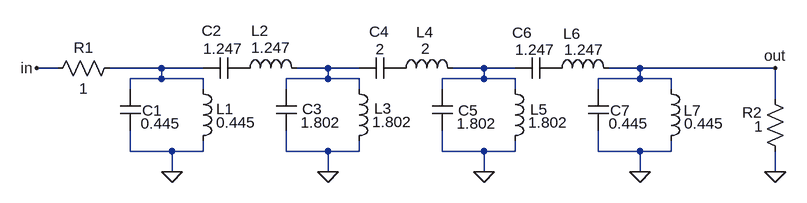
[diagram p0: schematic band_pass_prototype.asc]
band_pass_prototype.asc, the LTspice schematic file:
Version 4
SHEET 1 884 680
WIRE -256 -128 -288 -128
WIRE -96 -128 -176 -128
WIRE -32 -128 -96 -128
WIRE 160 -128 112 -128
WIRE 208 -128 160 -128
WIRE 400 -128 352 -128
WIRE 448 -128 400 -128
WIRE 640 -128 592 -128
WIRE 848 -128 640 -128
WIRE -96 -112 -96 -128
WIRE -96 -112 -144 -112
WIRE -32 -112 -96 -112
WIRE 160 -112 160 -128
WIRE 160 -112 96 -112
WIRE 208 -112 160 -112
WIRE 400 -112 400 -128
WIRE 400 -112 336 -112
WIRE 448 -112 400 -112
WIRE 640 -112 640 -128
WIRE 640 -112 576 -112
WIRE 688 -112 640 -112
WIRE -144 -96 -144 -112
WIRE -32 -96 -32 -112
WIRE 96 -96 96 -112
WIRE 208 -96 208 -112
WIRE 336 -96 336 -112
WIRE 448 -96 448 -112
WIRE 576 -96 576 -112
WIRE 688 -96 688 -112
WIRE 848 -80 848 -128
WIRE -144 0 -144 -32
WIRE -80 0 -144 0
WIRE -32 0 -32 -16
WIRE -32 0 -80 0
WIRE 96 0 96 -32
WIRE 160 0 96 0
WIRE 208 0 208 -16
WIRE 208 0 160 0
WIRE 336 0 336 -32
WIRE 400 0 336 0
WIRE 448 0 448 -16
WIRE 448 0 400 0
WIRE 576 0 576 -32
WIRE 640 0 576 0
WIRE 688 0 688 -16
WIRE 688 0 640 0
WIRE -80 32 -80 0
WIRE 160 32 160 0
WIRE 400 32 400 0
WIRE 640 32 640 0
WIRE 848 32 848 0
FLAG 848 32 0
FLAG -80 32 0
FLAG 160 32 0
FLAG 400 32 0
FLAG 640 32 0
FLAG -288 -128 in
FLAG 848 -128 out
SYMBOL res -160 -144 R90
WINDOW 0 0 56 VBottom 2
WINDOW 3 32 56 VTop 2
SYMATTR InstName R1
SYMATTR Value 1
SYMBOL res 864 16 R180
WINDOW 0 36 76 Left 2
WINDOW 3 35 54 Left 2
SYMATTR InstName R2
SYMATTR Value 1
SYMBOL ind 16 -112 R270
WINDOW 0 58 39 VTop 2
WINDOW 3 63 56 VBottom 2
SYMATTR InstName L2
SYMATTR Value 1.247
SYMBOL ind 256 -112 R270
WINDOW 0 56 53 VTop 2
WINDOW 3 62 54 VBottom 2
SYMATTR InstName L4
SYMATTR Value 2
SYMBOL ind 496 -112 R270
WINDOW 0 54 39 VTop 2
WINDOW 3 60 58 VBottom 2
SYMATTR InstName L6
SYMATTR Value 1.247
SYMBOL cap 80 -96 R0
WINDOW 0 40 31 Left 2
WINDOW 3 38 52 Left 2
SYMATTR InstName C3
SYMATTR Value 1.802
SYMBOL cap -160 -96 R0
WINDOW 0 34 33 Left 2
WINDOW 3 32 53 Left 2
SYMATTR InstName C1
SYMATTR Value 0.445
SYMBOL ind -48 -112 R0
WINDOW 0 36 47 Left 2
WINDOW 3 36 68 Left 2
SYMATTR InstName L1
SYMATTR Value 0.445
SYMBOL cap 32 -144 R90
WINDOW 0 -26 51 VBottom 2
WINDOW 3 -30 34 VTop 2
SYMATTR InstName C2
SYMATTR Value 1.247
SYMBOL ind 192 -112 R0
WINDOW 0 39 46 Left 2
WINDOW 3 36 67 Left 2
SYMATTR InstName L3
SYMATTR Value 1.802
SYMBOL cap 272 -144 R90
WINDOW 0 -25 33 VBottom 2
WINDOW 3 -29 32 VTop 2
SYMATTR InstName C4
SYMATTR Value 2
SYMBOL cap 320 -96 R0
WINDOW 0 40 33 Left 2
WINDOW 3 38 53 Left 2
SYMATTR InstName C5
SYMATTR Value 1.802
SYMBOL ind 432 -112 R0
WINDOW 0 39 48 Left 2
WINDOW 3 36 68 Left 2
SYMATTR InstName L5
SYMATTR Value 1.802
SYMBOL cap 512 -144 R90
WINDOW 0 -23 53 VBottom 2
WINDOW 3 -28 34 VTop 2
SYMATTR InstName C6
SYMATTR Value 1.247
SYMBOL cap 560 -96 R0
WINDOW 0 34 33 Left 2
WINDOW 3 32 53 Left 2
SYMATTR InstName C7
SYMATTR Value 0.445
SYMBOL ind 672 -112 R0
WINDOW 0 35 49 Left 2
WINDOW 3 36 69 Left 2
SYMATTR InstName L7
SYMATTR Value 0.445

The netlist it stands for:
* band_pass_prototype.asc
R1 N001 in 1
R2 0 out 1
L2 P001 N002 1.247
L4 P002 N003 2
L6 P003 out 1.247
C3 N002 0 1.802
C1 N001 0 0.445
L1 N001 0 0.445
C2 P001 N001 1.247
L3 N002 0 1.802
C4 P002 N002 2
C5 N003 0 1.802
L5 N003 0 1.802
C6 P003 N003 1.247
C7 out 0 0.445
L7 out 0 0.445
.backanno
.end